# EAGLE design untitled (EAGLE 9.6.2)
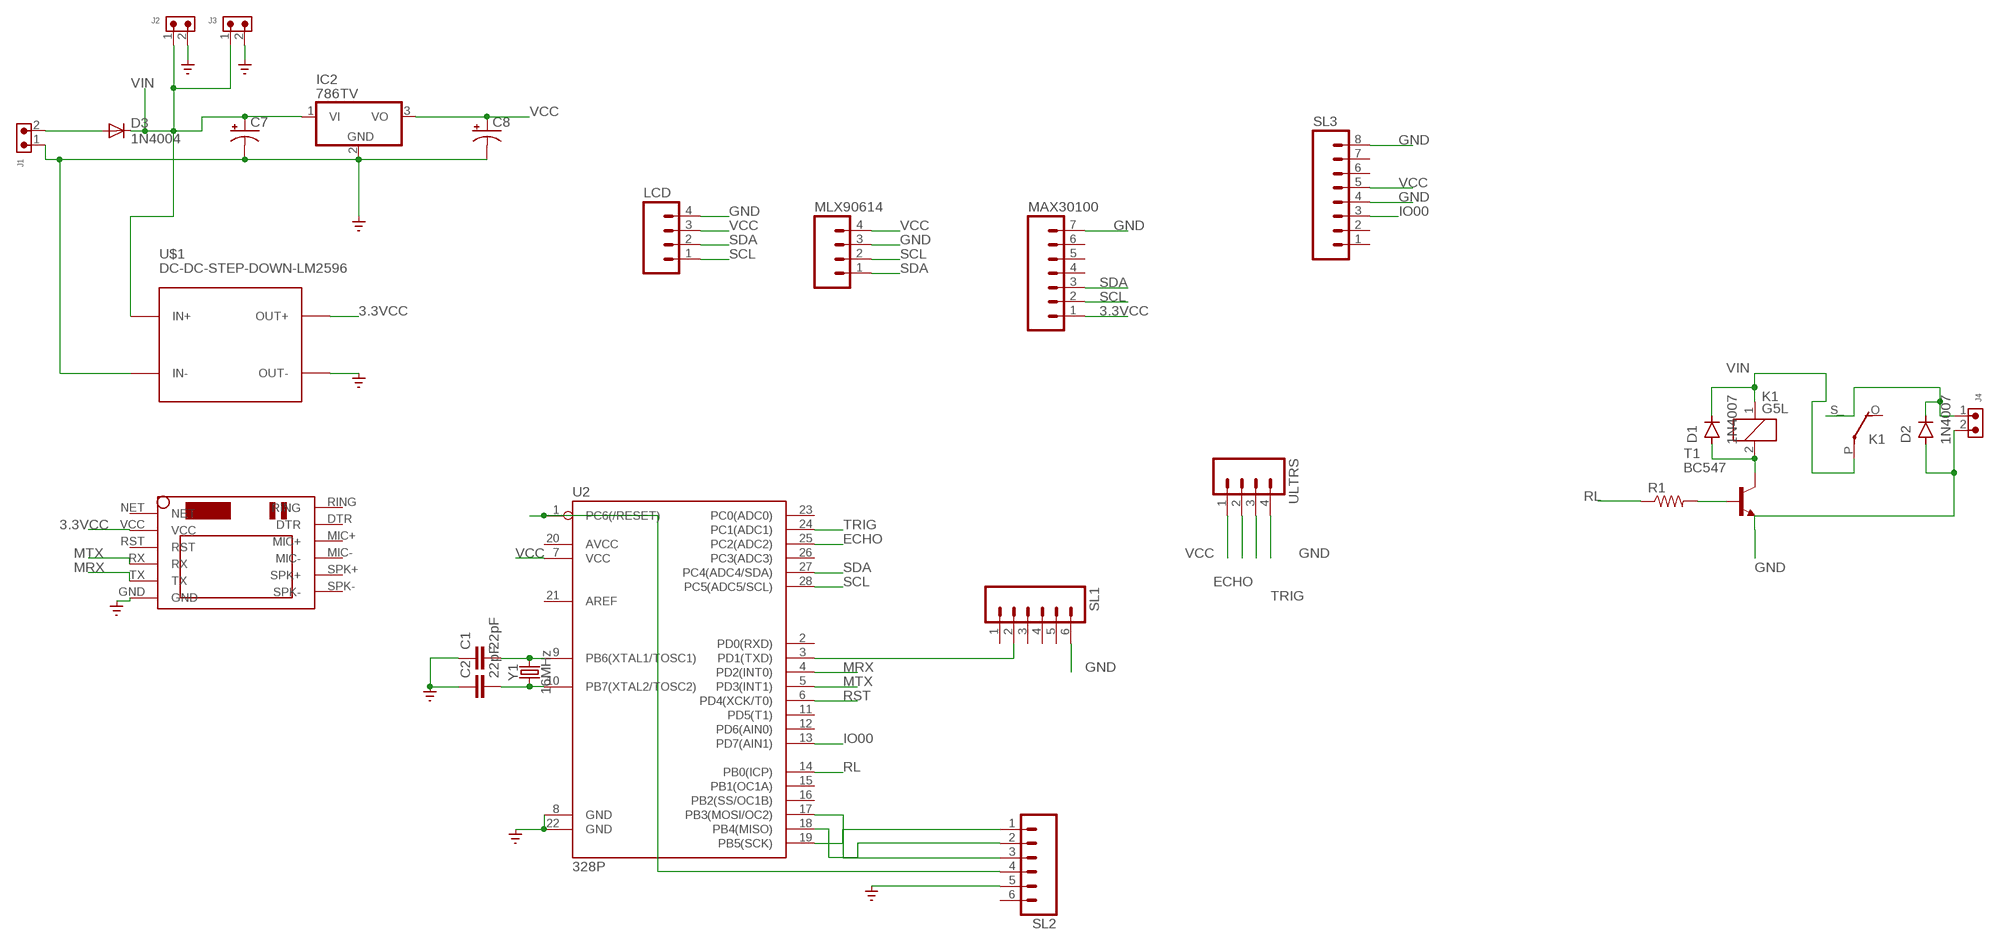
[diagram p0: schematic, sheet 1]

## Parts
C1  22pF  22PF-PTH-2.54MM-200V-5%  [CAP-PTH-2.54]
C2  22pF  22PF-PTH-2.54MM-200V-5%  [CAP-PTH-2.54]
C7  CAPACITOR-PE5-10.5  [E5-10,5]
C8  CAPACITOR-PE5-6  [E5-6]
D1  1N4007  [DO-41]
D2  1N4007  [DO-41]
D3  1N4004  [DO41-10]
IC2  786TV  [TO220V]
J1  691305530002  [691305530002]
J2  691305530002  [691305530002]
J3  691305530002  [691305530002]
J4  691305530002  [691305530002]
K1  G5L  [G5LE]
LCD  M04  [04P]
MAX30100  M07  [07P]
MLX90614  M04  [04P]
R1  R-US_0207/15  [0207/15]
SL1  M06  [06P]
SL2  M06  [06P]
SL3  M08  [08P]
T1  BC547  [TO92]
U2  328P  ATMEGA328P_PDIP  [DIP28]
U$1  DC-DC-STEP-DOWN-LM2596  [DC-DC-STEP-DOWN-LM2596]
U$2  SIM800LMODULE  [SIM800LMODULE]
ULTRS  M04  [04P]
Y1  16MHz  CRYSTAL-16MHZPTH-HC49US  [HC49US]

## Nets
3.3VCC: MAX30100.1 U$1.OUT+ U$2.VCC
ECHO: U2.25(PC2(ADC2)) ULTRS.2
GND: C1.1 C2.1 C7.- C8.- D2.A IC2.2(GND) J1.1 J2.2 J3.2 J4.2 LCD.4 MAX30100.7 MLX90614.3 SL1.6 SL2.5 SL3.4 SL3.8 T1.1(E) U2.8(GND) U2.22(GND) U$1.IN- U$1.OUT- U$2.GND ULTRS.4 ; supply symbol labelled SUPPLY_BRASTAN_GND_
IO00: SL3.3 U2.13(PD7(AIN1))
MRX: U2.4(PD2(INT0)) U$2.TX
MTX: U2.5(PD3(INT1)) U$2.RX
N$1: R1.2 T1.2(B)
N$2: C1.2 U2.9(PB6(XTAL1/TOSC1)) Y1.2
N$3: C2.2 U2.10(PB7(XTAL2/TOSC2)) Y1.1
N$4: SL1.2 U2.3(PD1(TXD))
N$5: D2.C J4.1 K1.S(2:S)
N$6: D1.A K1.2 T1.3(C)
N$14: SL2.4 U2.1(PC6(/RESET))
N$16: SL2.1 U2.19(PB5(SCK))
N$17: SL2.2 U2.18(PB4(MISO))
N$18: SL2.3 U2.17(PB3(MOSI/OC2))
N$21: D3.A J1.2
RL: R1.1 U2.14(PB0(ICP))
RST: U2.6(PD4(XCK/T0))
SCL: LCD.1 MAX30100.2 MLX90614.2 U2.28(PC5(ADC5/SCL))
SDA: LCD.2 MAX30100.3 MLX90614.1 U2.27(PC4(ADC4/SDA))
TRIG: U2.24(PC1(ADC1)) ULTRS.3
VCC: C8.+ IC2.3(VO) LCD.3 MLX90614.4 SL3.5 U2.7(VCC) ULTRS.1
VIN: C7.+ D1.C D3.C IC2.1(VI) J2.1 J3.1 K1.1 K1.P(2:P) U$1.IN+
Unconnected: K1.O(2:O) MAX30100.4 MAX30100.5 MAX30100.6 SL1.1 SL1.3 SL1.4 SL1.5 SL2.6 SL3.1 SL3.2 SL3.6 SL3.7 U2.2(PD0(RXD)) U2.11(PD5(T1)) U2.12(PD6(AIN0)) U2.15(PB1(OC1A)) U2.16(PB2(SS/OC1B)) U2.20(AVCC) U2.21(AREF) U2.23(PC0(ADC0)) U2.26(PC3(ADC3)) U$2.DTR U$2.MIC+ U$2.MIC- U$2.NET U$2.RING U$2.RST U$2.SPK+ U$2.SPK-

## Library data of the parts
C1 C2 = SparkFun-Capacitors:22PF: 22pF ceramic capacitors A capacitor is a passive two-terminal electrical component used to store electrical energy temporarily in an electric field.; PROD_ID: CAP-09128
C7 C8 = BeagleBone_Blue_R3:CAPACITOR-P: POLARIZED CAPACITOR, American symbol
D1 D2 = Diodes:1N4007: DIODE GEN PURP 1KV 1A DO41 Manufacturer's datasheet <https://www.mccsemi.com/pdf/Products/1N4001-1N4007(DO-41).pdf>; CREATED_BY: PCBLayout.com; DIGIKEY_PART_NUMBER: 1N4007MSCT-ND; MANUFACTURER: Micro Commercial Co; MPN: 1N4007; PACKAGE: DO-41
D3 = adafruit:1N4004: DIODE General purpose 1N400x type rectifier (With bigger pads) http://www.ladyada.net/library/pcb/eaglelibrary.html
IC2 = linear:78*: Positive VOLTAGE REGULATOR Source: http://cache.national.com/ds/LM/LM78L05.pdf http://www.fairchildsemi.com/ds/LM/LM7805.pdf
J1-J4 = Wurth_Connectors_WR-TBL Pluggable Connector:691305530002: WR-TBL Serie 3055 - 5,08 mm - PCB Header Vertical Entry with Plastic Latches KIND PROPERTIES Pitch 5.08 mm MATERIAL PROPERTIES Insulator Material PA66 Insulator Flammability Rating UL94 V-0 Insulator Color Green Terminal Material Copper Alloy Terminal Plating Tin-plated surface GENERAL INFORMATION Operating Temperature -40 up to +105 °C ELECTRICAL PROPERTIES IR UL 16 A Working Voltage [UL] 300 V (AC) Withstanding Voltage [UL] 2500 V (AC) Contact Resistance [UL] 20 mΩ CERTIFICATION UL Approval E315414 <https://www.we-online.com/catalog/media/o135349v209%20Family_WR-TBL3_6913055300xx.jpg> Details see: https://www.we-online.com/catalog/en/TBL_5_08_3055_6913055300XX/ Updated by Ella Wu 2019-12-30 2019(C) Wurth Elektronik; DATASHEET-URL: https://www.we-online.com/catalog/datasheet/691305530002.pdf; IR-UL: 16A; MOUNT: THT; PART-NUMBER: 691305530002; PINS: 2; PITCH: 5.08mm; TYPE: Vertical; WORKING-VOLTAGE-UL: 300V (AC)
K1 = relay:G5L: RELAY 1 x switch, 10 A/120 V AC, 8 A/30 V ADC, Omron; OC_FARNELL: unknown; OC_NEWARK: unknown
LCD MLX90614 ULTRS = con-amp-quick:M04: AMP QUICK CONNECTOR; OC_FARNELL: unknown; OC_NEWARK: unknown
MAX30100 = con-amp-quick:M07: AMP QUICK CONNECTOR; OC_FARNELL: unknown; OC_NEWARK: unknown
R1 = adafruit:R-US_: RESISTOR, American symbol
SL1 SL2 = con-amp-quick:M06: AMP QUICK CONNECTOR; OC_FARNELL: unknown; OC_NEWARK: unknown
SL3 = con-amp-quick:M08: AMP QUICK CONNECTOR; OC_FARNELL: unknown; OC_NEWARK: unknown
T1 = transistor:BC547: NPN TRANSISTOR
U2 = SparkFun-IC-Microcontroller:ATMEGA328P_PDIP: Atmel 328P Through hole ATMEGA328P uC used in the Arduino 32kb flash, 1k EEPROM, 2k SRAM Datasheet <http://www.sparkfun.com/datasheets/Components/SMD/ATMega328.pdf> SparkFun Products Storefront component: AVR 28 Pin 20MHz 32K 6A/D - ATMega328P <https://www.sparkfun.com/products/9061> (COM-09061) SparkFun Simon Says - Through-Hole Soldering Kit <https://www.sparkfun.com/products/10547> (KIT-10547) SparkFun Learn to Solder - Simon Says <https://www.sparkfun.com/products/13708> (KIT-13708) SparkFun BigTime Watch Kit <https://www.sparkfun.com/products/11734> (KIT-11734) SparkFun ClockIt <https://www.sparkfun.com/products/10930> (KIT-10930) SparkFun Serial Enabled LCD Kit <https://www.sparkfun.com/products/10097> (LCD-10097) SparkFun Simon Tilts - Through Hole Soldering Kit <https://www.sparkfun.com/products/12634> (KIT-12634) SparkFun Frequency Counter Kit <https://www.sparkfun.com/products/10140> (KIT-10140) FabFM Radio Kit <https://www.sparkfun.com/products/11043> (KIT-11043) SparkFun Binary Blaster Kit <https://www.sparkfun.com/products/12037> (KIT-12037) SparkFun Metro-Gnome <https://www.sparkfun.com/products/9236> (KIT-09236) ATmega328 with Arduino Optiboot (Uno) <https://www.sparkfun.com/products/10524> (DEV-10524); PROD_ID: IC-09136
U$1 = diy-modules:DC-DC-STEP-DOWN-LM2596: DC/DC Step-Down Regulator based on LM2596-ADJ chip LM2596 datasheet available here: http://www.ti.com/lit/ds/symlink/lm2596.pdf Click here to find device on ebay.com <http://www.ebay.com/sch/lm2596+power+regulator>
U$2 = SIM800LMODULE:SIM800LMODULE: SIM800L Module
Y1 = SparkFun-Clocks:CRYSTAL-16MHZ: 16MHz Crystal Digikey Example <http://www.digikey.com/product-search/en?keywords=535-9122-1-ND> Frequency: 16MHz Frequency Stability: ±50ppm Frequency Tolerance: ±20ppm Load Capacitance: 18pF SparkFun Products: Pro Micro -5V/16MHz <https://www.sparkfun.com/products/12640> SparkFun Serial Enabled LCD Kit <https://www.sparkfun.com/products/10097>; PROD_ID: XTAL-08181; SF_ID: COM-00536

## Board
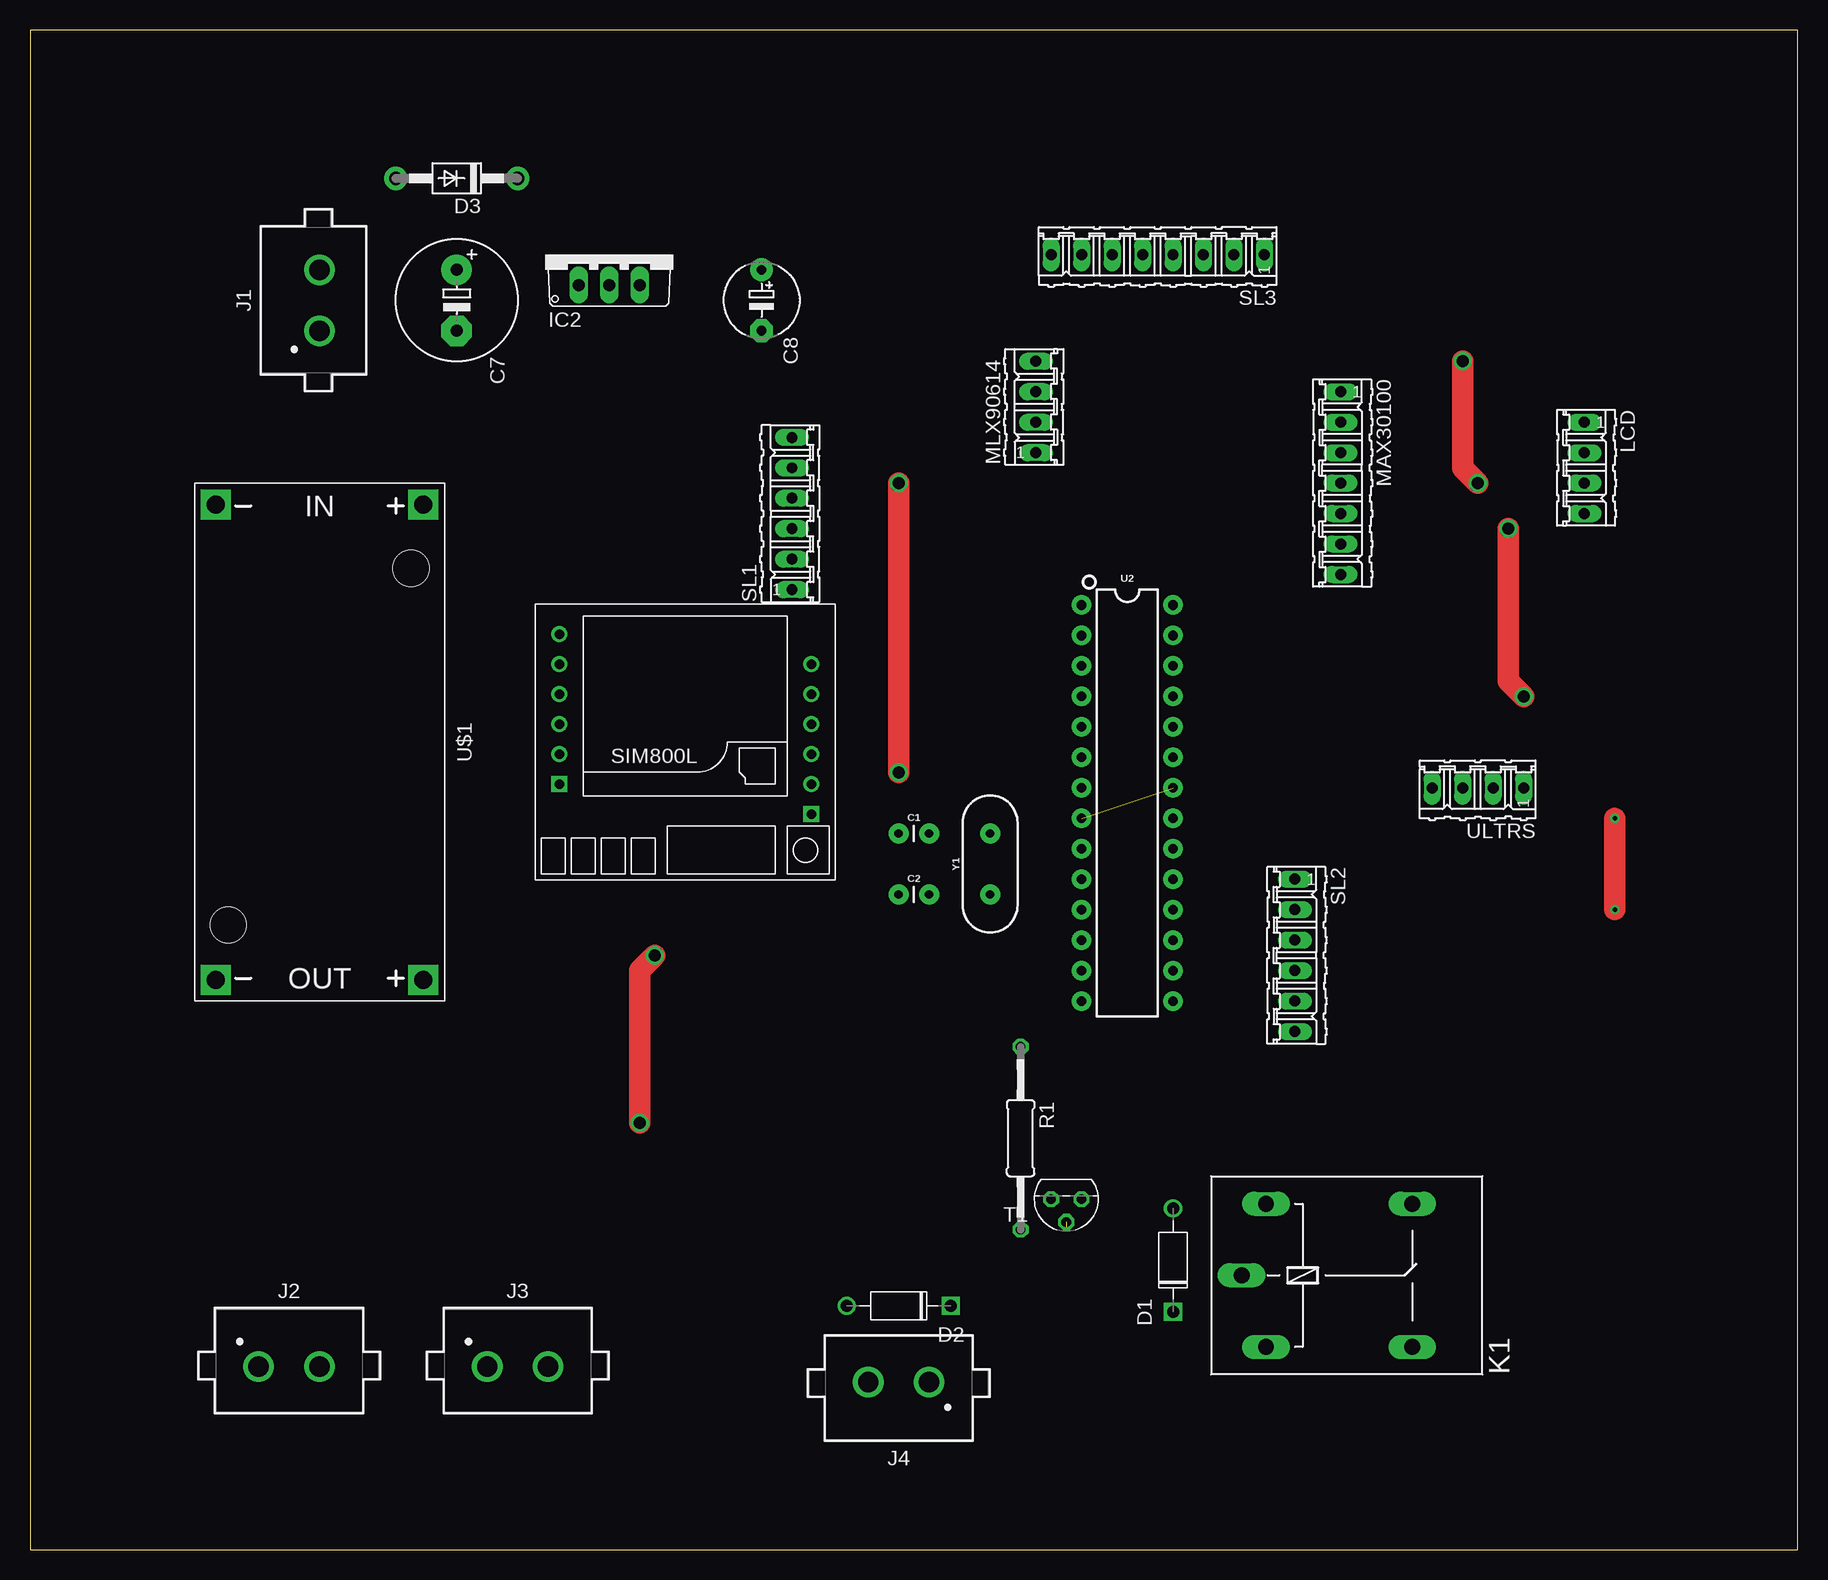
[diagram p1: board, top side]
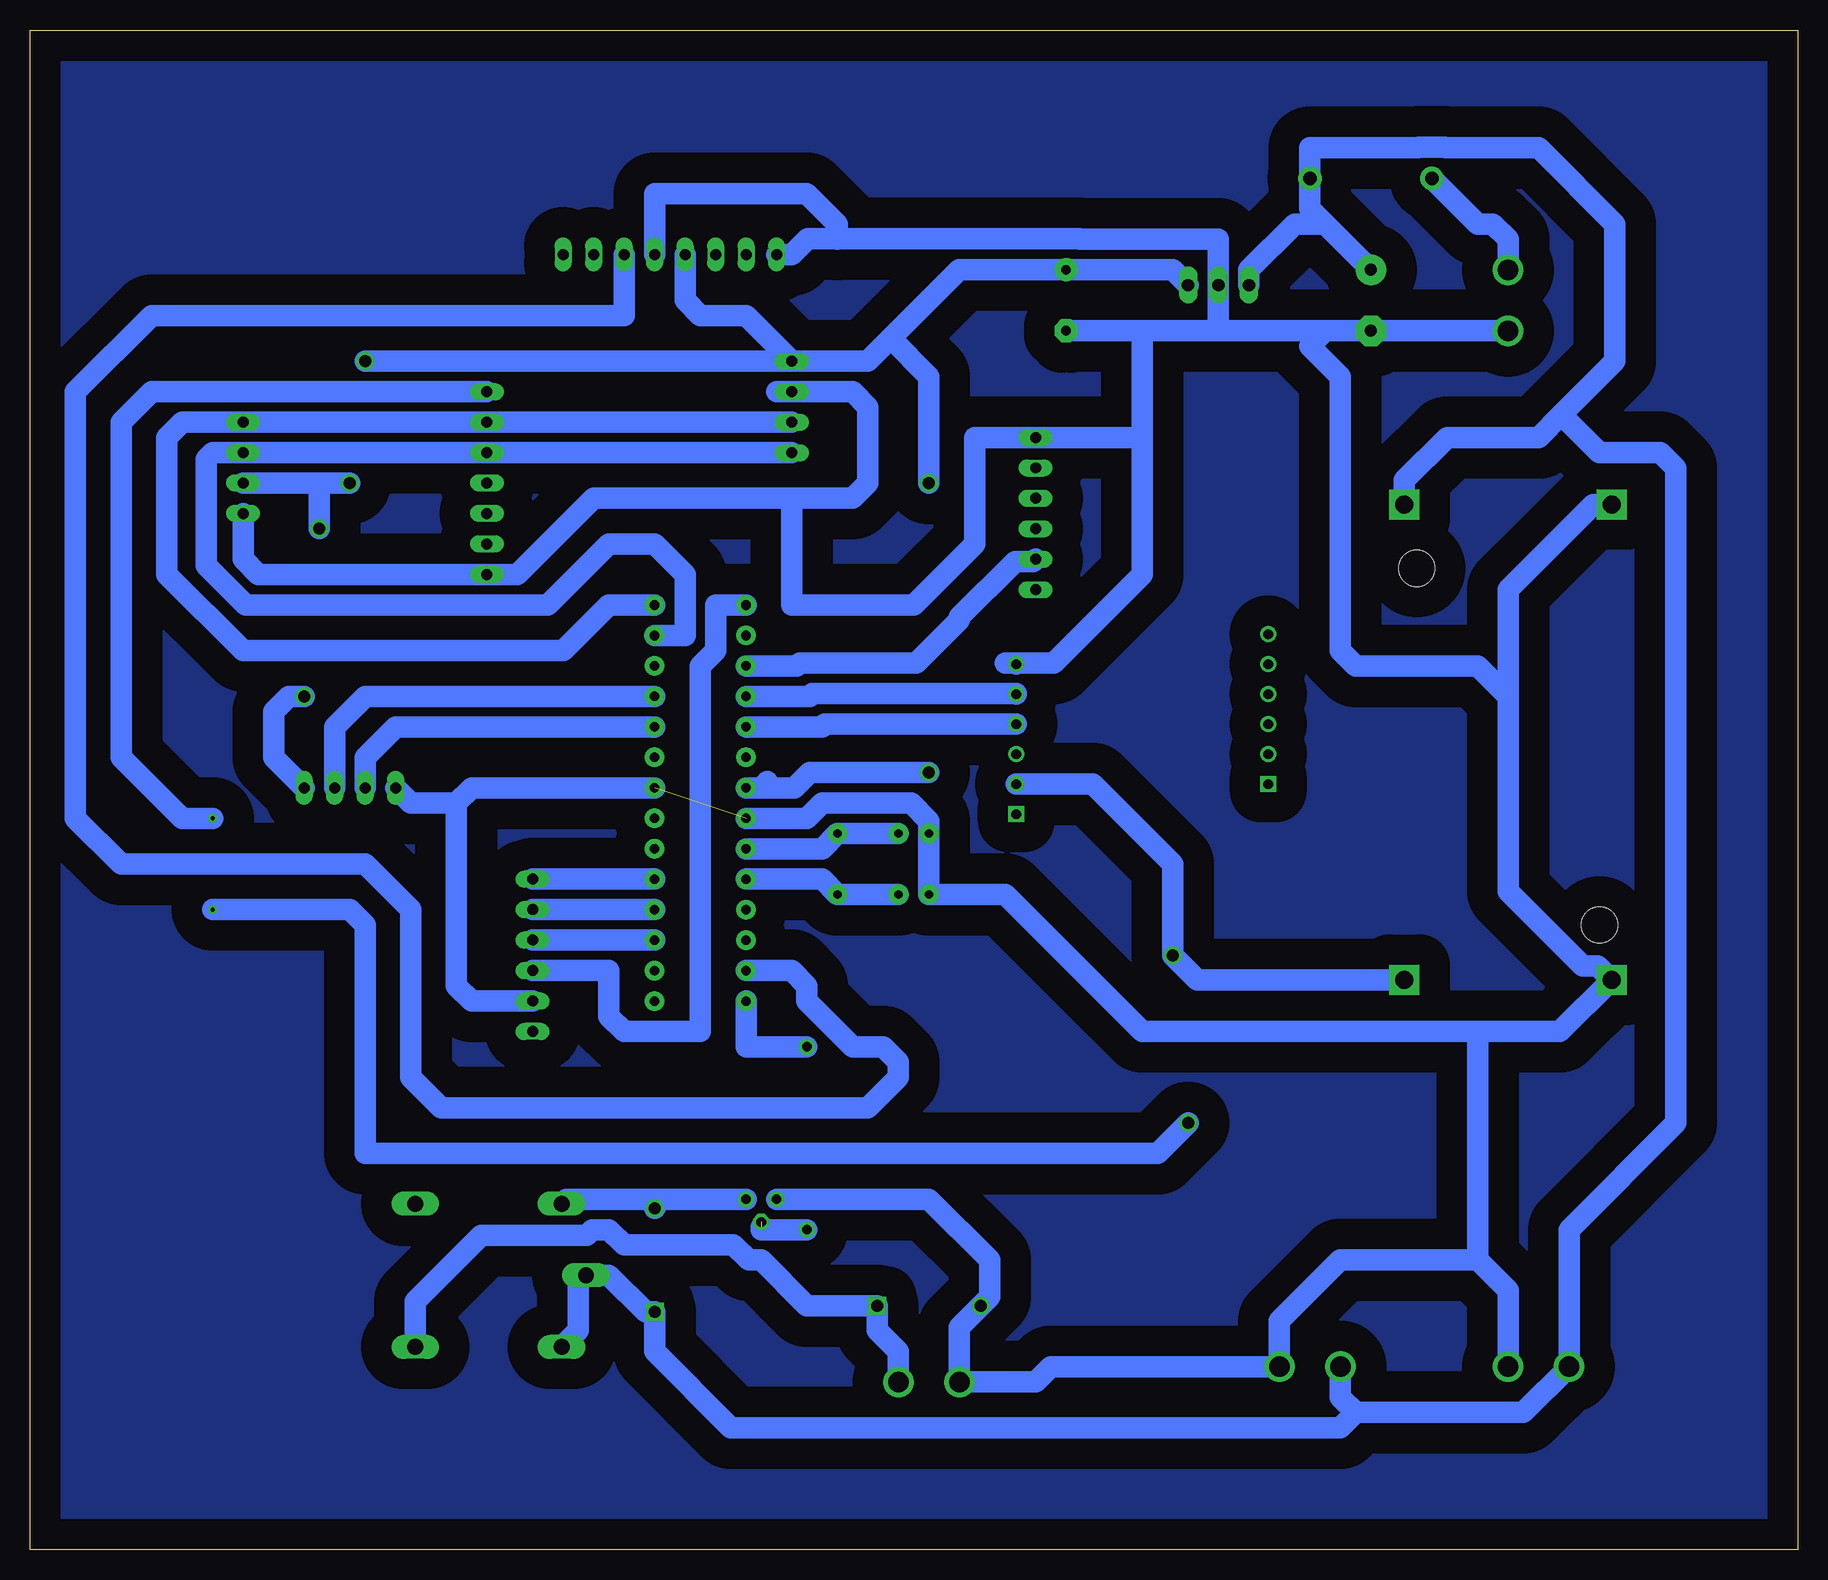
[diagram p2: board, bottom side, seen from below]

Size 147.3 x 126.67 mm. Coordinates in mm from the lower left corner, seen from the top.
Outline: 0,0 147.3,0 147.3,126.67 0,126.67 0,0
Copper layers (1*16): Top 0.035mm / dielectric 1.5mm / Bottom 0.035mm
Design rules "default *": minimum track width 6mil, minimum drill 0.35mm, track to track 30mil, track to pad 30mil, pad to pad 30mil, via to via 30mil, smd to smd 6mil, copper to edge 40mil, drill to drill 6mil, minimum pad ring 10mil, minimum via ring 8mil, stop-mask expansion 4mil, vias tented up to drill 0mil, thermal gap 10mil

### Footprints (pad centres in the part's own frame; a part is rotated, then mirrored left to right if it is on the bottom)
CAP-PTH-2.54 = drill 0.7 pad 1.651: 1 -1.27,0; 2 1.27,0
E5-10,5 = drill 1.016 pad 2.54: + -2.54,0 | drill 1.016 pad 2.54 octagon: - 2.54,0
E5-6 = drill 0.813 pad 1.905: + -2.54,0 | drill 0.813 pad 1.905 octagon: - 2.54,0
DO-41 = drill 1: A 4.325,0 | drill 1 square: C -4.325,0
DO41-10 = drill 1.118 pad 1.93: A 5.08,0; C -5.08,0
TO220V = drill 1.016 long: 1 -2.54,-2.54; 2 0,-2.54; 3 2.54,-2.54
691305530002 = drill 1.7: 1 -2.54,0; 2 2.54,0
G5LE = drill 1.321 long: 1 -7.493,-5.969; 2 -7.493,5.969; O 4.699,5.969; P -9.525,0; S 4.699,-5.969
04P = drill 0.914 long: 1 -3.81,0; 2 -1.27,0; 3 1.27,0; 4 3.81,0
07P = drill 0.914 long: 1 -7.62,0; 2 -5.08,0; 3 -2.54,0; 4 0,0; 5 2.54,0; 6 5.08,0; 7 7.62,0
0207/15 = drill 0.813 octagon: 1 -7.62,0; 2 7.62,0
06P = drill 0.914 long: 1 -6.35,0; 2 -3.81,0; 3 -1.27,0; 4 1.27,0; 5 3.81,0; 6 6.35,0
08P = drill 0.914 long: 1 -8.89,0; 2 -6.35,0; 3 -3.81,0; 4 -1.27,0; 5 1.27,0; 6 3.81,0; 7 6.35,0; 8 8.89,0
TO92 = drill 0.813 octagon: 1 1.27,0; 2 0,1.905; 3 -1.27,0
DIP28 = drill 0.813 pad 1.626: 1 -16.51,-3.81; 2 -13.97,-3.81; 3 -11.43,-3.81; 4 -8.89,-3.81; 5 -6.35,-3.81; 6 -3.81,-3.81; 7 -1.27,-3.81; 8 1.27,-3.81; 9 3.81,-3.81; 10 6.35,-3.81; 11 8.89,-3.81; 12 11.43,-3.81; 13 13.97,-3.81; 14 16.51,-3.81; 15 16.51,3.81; 16 13.97,3.81; 17 11.43,3.81; 18 8.89,3.81; 19 6.35,3.81; 20 3.81,3.81; 21 1.27,3.81; 22 -1.27,3.81; 23 -3.81,3.81; 24 -6.35,3.81; 25 -8.89,3.81; 26 -11.43,3.81; 27 -13.97,3.81; 28 -16.51,3.81
DC-DC-STEP-DOWN-LM2596 = drill 1.5 pad 2.5 square: IN+ -19.812,8.636; IN- -19.812,-8.636; OUT+ 19.812,8.636; OUT- 19.812,-8.636 | hole 3: -14.478,7.62; 15.24,-7.62
SIM800LMODULE = drill 0.8: DTR 10.5,1; GND -10.5,-6.5; MIC+ 10.5,-1.5; MIC- 10.5,-4; RST -10.5,1; RX -10.5,-1.5; SPK+ 10.5,-6.5; SPK- 10.5,-9; TX -10.5,-4; VCC -10.5,3.5 | drill 0.8 square: NET -10.5,6; RING 10.5,3.5
HC49US = drill 0.7 pad 1.651: 1 -2.54,0; 2 2.54,0

### Placement (x,y rotation side)
C1  73.66,59.69 0 top
C2  73.66,54.61 0 top
C7  35.56,104.14 270 top
C8  60.96,104.14 270 top
D1  95.25,24.13 90 top
D2  72.39,20.32 180 top
D3  35.56,114.3 180 top
IC2  48.26,107.95 0 top
J1  24.13,104.14 90 top
J2  21.59,15.24 0 top
J3  40.64,15.24 0 top
J4  72.39,13.97 180 top
K1  110.49,22.86 0 top
LCD  129.54,90.17 270 top
MAX30100  109.22,88.9 270 top
MLX90614  83.82,95.25 90 top
R1  82.55,34.29 270 top
SL1  63.5,86.36 90 top
SL2  105.41,49.53 270 top
SL3  93.98,107.95 180 top
T1  86.36,29.21 180 top
U2  91.44,62.23 270 top
U$1  24.13,67.31 270 top
U$2  54.61,67.31 180 top
ULTRS  120.65,63.5 180 top
Y1  80.01,57.15 90 top

### Tracks (layer width: path | path; a pad name or v marks a point on that pad's centre or on a via)
3.3VCC  (via drill 0.35, 1)
  Top 1.778: v50.8,35.56 50.8,48.26 v52.07,49.53 | v132.08,60.96 v132.08,53.34
  Bottom 1.778: MAX30100.1 137.16,96.52 139.7,93.98 139.7,66.04 134.62,60.96 v132.08,60.96 | v50.8,35.56 53.34,33.02 119.38,33.02 119.38,52.07 120.65,53.34 v132.08,53.34 | U$2.VCC 58.73,63.81 52.07,57.15 v52.07,49.53 50.04,47.5 U$1.OUT+
ECHO
  Bottom 1.778: ULTRS.2 121.92,68.58 119.38,71.12 U2.25
GND  (1 unrouted)
  Bottom 1.778: J1.1 C7.- 39.37,101.6 | 39.37,101.6 48.26,101.6 | 48.26,101.6 IC2.2 48.26,109.22 59.82,109.22 59.88,109.28 80.01,109.28 | 39.37,101.6 40.64,100.33 38.1,97.79 38.1,74.93 36.83,73.66 26.67,73.66 24.13,71.12 | 48.26,101.6 54.61,101.6 | 54.61,101.6 C8.- | 83.82,87.63 100.33,87.63 106.68,81.28 MAX30100.7 128.27,81.28 129.54,82.55 LCD.4 | 83.82,87.63 78.74,87.63 77.47,88.9 77.47,95.25 78.74,96.52 MLX90614.3 85.09,96.52 | U2.8 82.55,60.96 81.28,62.23 73.88,62.23 72.39,60.74 C1.1 C2.1 66.04,54.61 54.61,43.18 26.67,43.18 | 26.67,43.18 19.81,43.18 U$1.OUT- 16.66,48.66 17.92,48.66 24.13,54.88 24.13,71.12 | U$1.IN- 17.02,87.12 24.13,80.01 24.13,71.12 | SL2.5 110.49,45.72 111.76,46.99 111.76,62.23 | 111.76,62.23 110.49,63.5 U2.22 | ULTRS.4 115.57,62.23 111.76,62.23 | 26.67,43.18 26.67,24.13 | 26.67,24.13 24.13,21.59 J2.2 | 26.67,24.13 38.1,24.13 43.18,19.05 J3.2 62.23,15.24 63.5,13.97 J4.2 69.85,18.54 D2.A 67.31,21.07 67.31,24.13 72.39,29.21 T1.1 | 54.61,101.6 54.61,92.71 | 54.61,92.71 54.61,81.28 62,73.89 65.19,73.89 | 54.61,92.71 SL1.6 68.58,92.71 68.58,83.82 73.66,78.74 83.82,78.74 83.82,87.63 | SL3.8 83.82,107.95 82.49,109.28 80.01,109.28 | SL3.4 95.25,113.03 82.55,113.03 80.01,110.49 80.01,109.28 | 80.01,109.28 80.01,109.22 | U$2.GND 65.19,73.89 | 65.19,73.89 66.04,73.89
IO00
  Bottom 1.778: U2.13 83.82,48.26 82.55,46.99 82.55,45.72 78.74,41.91 76.2,41.91 74.93,40.64 74.93,39.37 77.47,36.83 113.03,36.83 115.57,39.37 115.57,53.34 119.38,57.15 139.7,57.15 143.51,60.96 143.51,96.52 137.16,102.87 97.79,102.87 SL3.3
MRX
  Bottom 1.778: 65.15,71.35 65.11,71.35 | U2.4 82.33,71.12 82.1,71.35 66.04,71.35 65.15,71.35 | U$2.TX 65.15,71.35
MTX
  Bottom 1.778: U$2.RX 81.05,68.81 81.28,68.58 U2.5
N$1  (1 unrouted)
  Bottom 1.778: 86.36,26.89 86.36,26.67 R1.2
N$2
  Bottom 1.778: U2.9 81.28,58.42 Y1.2 C1.2
N$3
  Bottom 1.778: U2.10 81.28,55.88 Y1.1 C2.2
N$4
  Bottom 1.778: SL1.2 63.68,82.37 65.19,82.37 69.85,77.71 69.85,77.47 73.43,73.89 83.15,73.89 83.38,73.66 U2.3
N$5
  Bottom 1.778: J4.1 74.93,16.51 76.72,18.3 D2.C | D2.C 76.72,20.21 | K1.S 115.19,20.7 109.7,26.19 100.91,26.19 100.43,26.67 99.06,26.67 97.79,25.4 88.68,25.4 87.41,24.13 86.36,24.13 82.55,20.32 D2.C
N$6
  Bottom 1.778: K1.2 102.62,29.21 95.25,29.21 | T1.3 95.25,29.21 | 95.25,29.21 95.25,28.65 | 95.25,28.65 95.16,28.55 | D1.A 95.25,28.65
N$7
  pour Bottom (isolate 2.54): 0,127 147.32,127 147.32,0 0,0
N$14
  Bottom 1.778: U2.1 90.17,78.74 90.17,74.93 91.44,73.66 91.44,43.18 97.79,43.18 99.06,44.45 99.06,48.26 SL2.4
N$16
  Bottom 1.778: U2.19 SL2.1
N$17
  Bottom 1.778: SL2.2 U2.18
N$18
  Bottom 1.778: U2.17 SL2.3
N$21
  Bottom 1.778: D3.A 26.67,110.49 25.4,110.49 24.13,109.22 J1.2
RL
  Bottom 1.778: R1.1 87.63,41.91 U2.14
SCL
  Bottom 1.778: MLX90614.2 MAX30100.2 | U2.28 99.06,78.74 102.87,74.93 129.54,74.93 135.89,81.28 135.89,92.71 134.62,93.98 MAX30100.2 | LCD.1 MAX30100.2
SDA
  Bottom 1.778: LCD.2 MAX30100.3 | MAX30100.3 107.95,91.44 | MAX30100.3 MLX90614.1 LCD.2 | U2.27 92.71,76.2 92.71,81.28 95.25,83.82 99.06,83.82 104.14,78.74 129.32,78.74 132.61,82.03 132.61,90.91 132.08,91.44 LCD.2
TRIG
  Bottom 1.778: ULTRS.3 119.38,66.04 116.84,68.58 U2.24
VCC  (via drill 1)
  Top 1.778: v120.65,88.9 119.38,90.17 v119.38,99.06 | v72.39,64.77 v72.39,88.9 | v124.46,71.12 123.19,72.39 v123.19,85.09
  Bottom 1.778: IC2.3 52.07,106.68 C8.+ 69.85,106.68 75.56,100.97 | LCD.3 123.19,88.9 | 123.19,88.9 v120.65,88.9 | v119.38,99.06 MLX90614.4 | 75.56,100.97 77.47,99.06 82.55,99.06 MLX90614.4 | U2.7 86.36,63.5 | 86.36,63.5 85.85,64.01 | 86.36,63.5 83.6,63.5 82.33,64.77 v72.39,64.77 | 75.56,100.97 72.39,97.79 v72.39,88.9 72.39,90.17 | ULTRS.1 127,66.04 127,69.85 125.73,71.12 v124.46,71.12 | v123.19,85.09 123.19,88.9 | MLX90614.4 87.63,102.87 91.44,102.87 92.71,104.14 SL3.5
VIN
  Bottom 1.778: 39.37,110.49 40.64,111.76 D3.C 40.64,116.84 31.64,116.84 31.56,116.92 29.4,116.92 29.32,116.84 21.59,116.84 15.24,110.49 15.24,99.06 19.69,94.61 | 39.37,110.49 C7.+ | 39.37,110.49 41.91,110.49 45.72,106.68 IC2.1 | 19.69,94.61 21.59,92.71 29.21,92.71 32.77,89.15 U$1.IN+ | 19.69,94.61 16.51,91.44 11.43,91.44 10.16,90.17 10.16,35.56 19.05,26.67 J2.1 22.86,11.43 36.83,11.43 | 36.83,11.43 38.1,12.7 J3.1 | 36.83,11.43 38.1,10.16 88.9,10.16 95.25,16.51 D1.C 96.01,19.8 99.06,22.86 K1.P 101.6,22.23 101.6,18.29 K1.1